# Altium schematic sheet Water Channel.SchDoc
size A; Engineer: NH; SheetNumber: 2; SheetTotal: 4
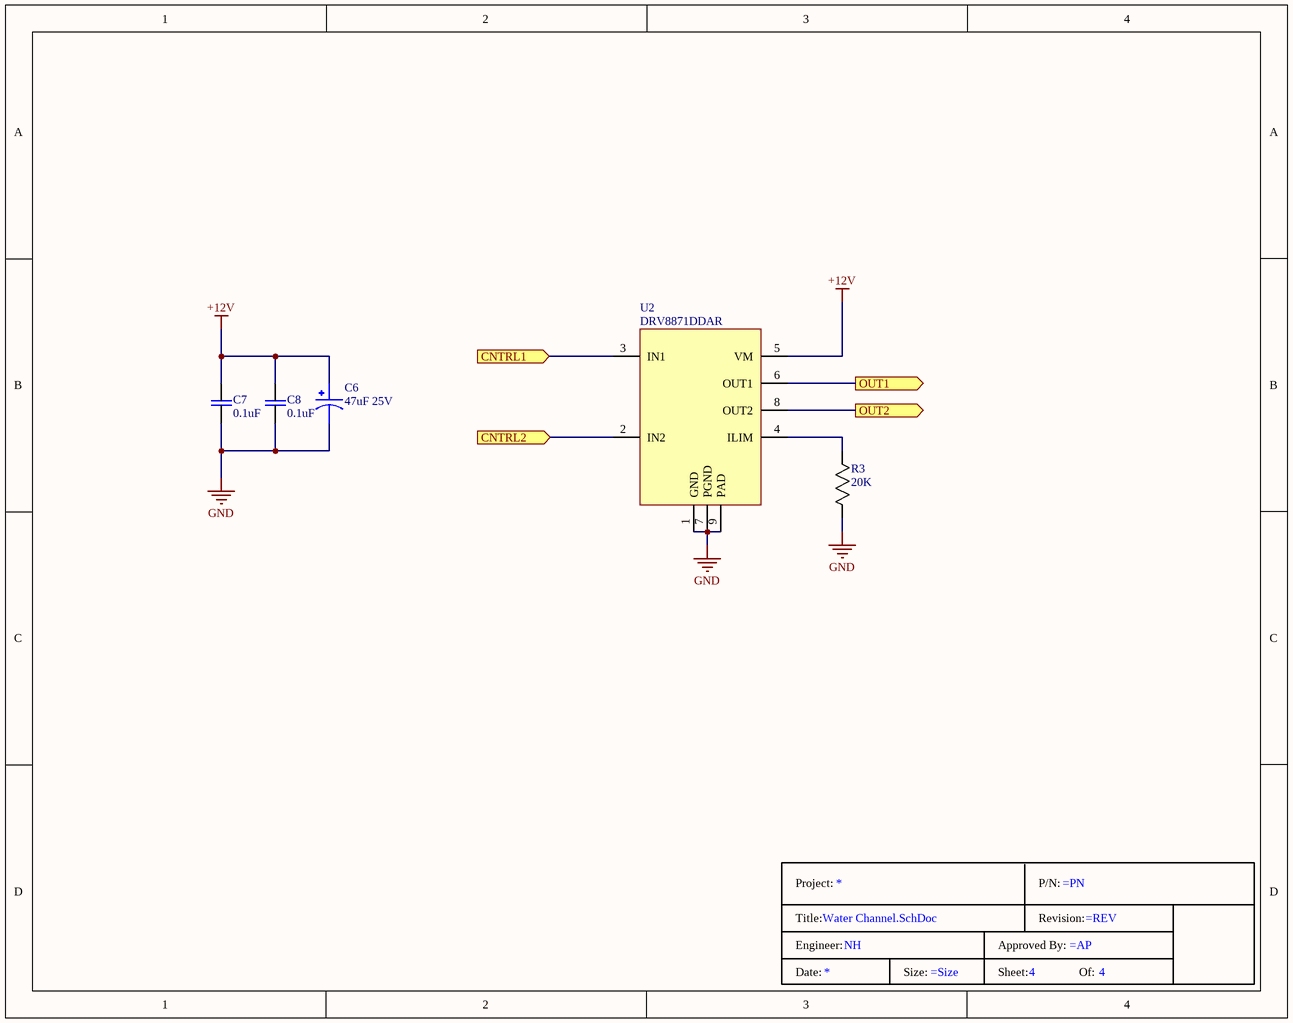
[diagram p0: Water Channel.SchDoc]

## Parts
*  Tital_block_1  (value not drawn)  (graphical)
C6  47uF 25V  [A768EB476M1ELAE042]
C7  0.1uF  [C0603]
C8  0.1uF  [C0603]
R3  20K  [R0603]
U2  DRV8871DDAR  [TI-8-SO PowerPad]

## Ports
CNTRL1 (in), CNTRL2 (in), OUT1 (out), OUT2 (out)

## Nets
+12V: C6.1 C7.2 C8.2 U2.5(VM)
GND: C6.2 C7.1 C8.1 R3.1 U2.1(GND) U2.7(PGND) U2.9(PAD)
CNTRL1: U2.3(IN1) ; port CNTRL1
CNTRL2: U2.2(IN2) ; port CNTRL2
OUT1: U2.6(OUT1) ; port OUT1
OUT2: U2.8(OUT2) ; port OUT2
NetR3_2: R3.2 U2.4(ILIM)

## Notes on the sheet
- (in symbol Tital_block_1) Project:; P/N:; Title:; Revision:; Engineer:; Approved By:; Date:; Size:; Sheet:; Of:

## Library data of the parts
C6 = A768EB476M1ELAE042: CAP ALUM POLY 47UF 20% 25V SMD; Manufacturer: KEMET; Manufacturer P/N: A768EB476M1ELAE042
C7 C8 = C0603C104K5RECAUTO: CAP CER 0.10UF 50V X7R 0603; Manufacturer: KEMET; Manufacturer P/N: C0603C104K5RECAUTO
R3 = RC0603FR-0730KL: RES 30K OHM 1% 1/10W 0603; Manufacturer: YAGEO; Manufacturer P/N: RC0603FR-0730KL
U2 = DRV8871DDAR: Unipolar Motor Driver NMOS PWM 8-SO PowerPad; Manufacturer: Texas Instruments; Manufacturer P/N: DRV8871DDAR